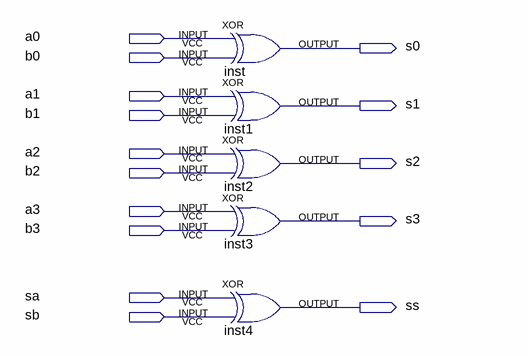
[diagram p0: schematic sheet]
// Quartus schematic ULAxor.bdf as structural Verilog: 5 symbols, 15 pins
module ULAxor (
  input  a0,
  input  b0,
  input  a1,
  input  b1,
  input  a2,
  input  b2,
  input  a3,
  input  b3,
  input  sa,
  input  sb,
  output s0,
  output s1,
  output s2,
  output s3,
  output ss
);

  xor inst (s0, a0, b0);
  xor inst1 (s1, a1, b1);
  xor inst2 (s2, a2, b2);
  xor inst3 (s3, a3, b3);
  xor inst4 (ss, sa, sb);
endmodule
